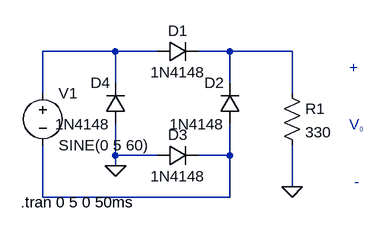
[diagram p0: schematic Retificador de onda completa.asc]
Retificador de onda completa.asc, the LTspice schematic file:
Version 4
SHEET 1 880 680
WIRE 80 112 -32 112
WIRE 144 112 80 112
WIRE 256 112 208 112
WIRE 352 112 256 112
WIRE 80 160 80 112
WIRE 256 160 256 112
WIRE -32 176 -32 112
WIRE 352 176 352 112
WIRE 80 272 80 224
WIRE 144 272 80 272
WIRE 256 272 256 224
WIRE 256 272 208 272
WIRE 80 288 80 272
WIRE 352 320 352 256
WIRE -32 336 -32 256
WIRE 256 336 256 272
WIRE 256 336 -32 336
FLAG 80 288 0
FLAG 352 320 0
SYMBOL diode 144 128 R270
WINDOW 0 32 32 VTop 2
WINDOW 3 0 32 VBottom 2
SYMATTR InstName D1
SYMATTR Value 1N4148
SYMBOL diode 272 224 R180
WINDOW 0 24 64 Left 2
WINDOW 3 24 0 Left 2
SYMATTR InstName D2
SYMATTR Value 1N4148
SYMBOL diode 144 288 R270
WINDOW 0 32 32 VTop 2
WINDOW 3 0 32 VBottom 2
SYMATTR InstName D3
SYMATTR Value 1N4148
SYMBOL diode 96 224 R180
WINDOW 0 24 64 Left 2
WINDOW 3 24 0 Left 2
SYMATTR InstName D4
SYMATTR Value 1N4148
SYMBOL voltage -32 160 R0
WINDOW 123 0 0 Left 0
WINDOW 39 0 0 Left 0
SYMATTR InstName V1
SYMATTR Value SINE(0 5 60)
SYMBOL res 336 160 R0
SYMATTR InstName R1
SYMATTR Value 330
TEXT -66 344 Left 2 !.tran 0 5 0 50ms
TEXT 440 136 Left 2 ;+
TEXT 448 312 Left 2 ;-
TEXT 440 224 Left 2 ;V
TEXT 456 232 Left 0 ;0

The netlist it stands for:
* Retificador de onda completa.asc
D1 N001 N002 1N4148
D2 N003 N002 1N4148
D3 0 N003 1N4148
D4 0 N001 1N4148
V1 N001 N003 SINE(0 5 60)
R1 N002 0 330
.model D D
.lib standard.dio
.tran 0 5 0 50ms
* +
* -
* V
* 0
.backanno
.end